# Altium schematic sheet BoostSupply.SchDoc
size A4
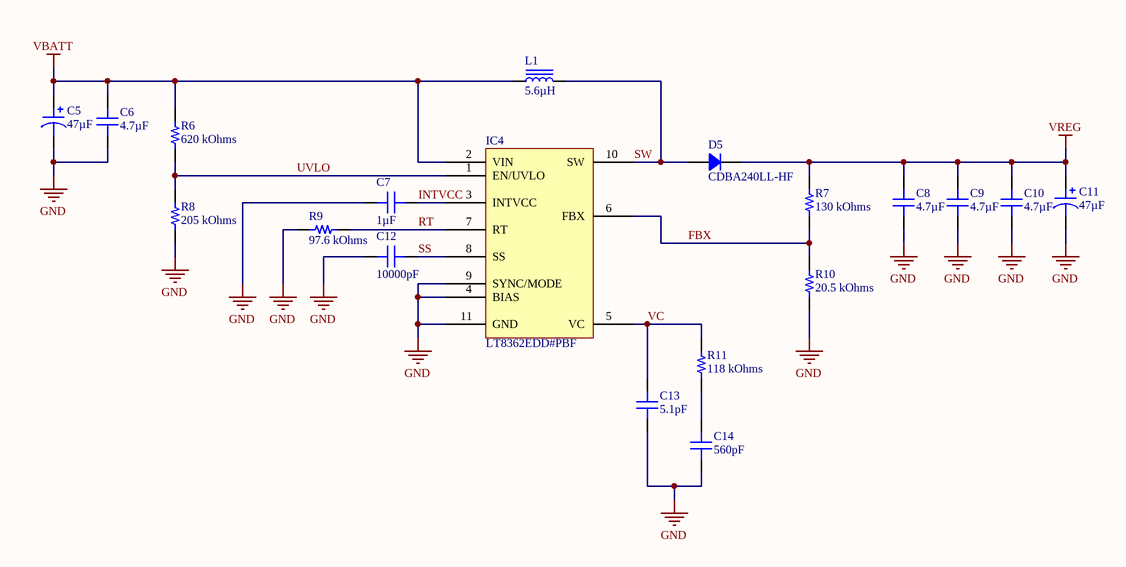
[diagram p0: BoostSupply.SchDoc]

## Parts
C5  47µF  [CAP ALSMD 6.6MM H6.1MM]
C6  4.7µF  [CAP 0805_2012]
C7  1µF  [CAP 0603_1608]
C8  4.7µF  [CAP 0805_2012]
C9  4.7µF  [CAP 0805_2012]
C10  4.7µF  [CAP 0805_2012]
C11  47µF  [CAP ALSMD 6.6MM H6.1MM]
C12  10000pF  [CAP 0603_1608]
C13  5.1pF  [CAP 0603_1608]
C14  560pF  [CAP 0603_1608]
D5  CDBA240LL-HF  [DO214AC SMA]
IC4  LT8362EDD#PBF  [ANALOG DEV DFN-10 3X3MM DD]
L1  5.6µH  [TDK SLF12575]
R6  620 kOhms  [RES 0603_1608]
R7  130 kOhms  [RES 0603_1608]
R8  205 kOhms  [RES 0603_1608]
R9  97.6 kOhms  [RES 0603_1608]
R10  20.5 kOhms  [RES 0603_1608]
R11  118 kOhms  [RES 0603_1608]

## Nets
GND: C5.2 C6.1 C7.2 C8.1 C9.1 C10.1 C11.2 C12.2 C13.1 C14.1 IC4.4(BIAS) IC4.9(SYNC/MODE) IC4.11(GND) R8.1 R9.2 R10.1
VBATT: C5.1 C6.2 IC4.2(VIN) L1.1 R6.2
VREG: C8.2 C9.2 C10.2 C11.1 D5.2 R7.2
FBX: IC4.6(FBX) R7.1 R10.2
INTVCC: C7.1 IC4.3(INTVCC)
RT: IC4.7(RT) R9.1
SS: C12.1 IC4.8(SS)
SW: D5.1 IC4.10(SW) L1.2
UVLO: IC4.1(EN/UVLO) R6.1 R8.2
VC: C13.2 IC4.5(VC) R11.2
NetC14_2: C14.2 R11.1

## Notes on the sheet
- Title
- Size:
- Date:
- A4
- Number:
- Time:
- Revision:
- Sheet
- of
- File:

## Library data of the parts
C5 C11 = HHXD250ARA470MF61G: ALUMINUM CAPACITOR; Manufacturer: United Chemi-Con; ESR (Equivalent Series Resistance): 50mOhm; Lifetime @ Temp.: 5000 Hrs @ 105°C; Ripple Current @ High Frequency: 1.3A @ 100kHz; Ripple Current @ Low Frequency: 130mA @ 120Hz; Surface Mount Land Size: 0.260" L x 0.260" W (6.60mm x 6.60mm); Tolerance: ±20%; Type: Hybrid; Voltage - Rated: 25V; Part Number: HHXD250ARA470MF61G; Applications: Automotive; Capacitance: 47µF; ComponentLink1Description: Datasheet; ComponentLink1URL: http://www.chemi-con.co.jp/cgi-bin/CAT_DB/SEARCH/cat_db_al.cgi?e=e&j=p&pdfname=hxd; ComponentLink2Description: DigiKey Link; ComponentLink2URL: http://digikey.com/product-detail/en/united-chemi-con/HHXD250ARA470MF61G/565-HHXD250ARA470MF61GCT-ND/10487166; Device Package: Radial, Can - SMD; Height - Seated (Max): 0.240" (6.10mm); LastUpdated: 21/01/2020 04:05:20; Lifecycle Status: Active; Minimum Order: 1; Mounting Type: Surface Mount; Operating Temperature: -55°C ~ 105°C; Package / Case: Radial, Can - SMD; Packaging: TapeAndReel; PartId: 2188; Part Status: Active; Price: 0.19; Ratings: AEC-Q200; Series: HXD; Size / Dimension: 0.248" Dia (6.30mm); Supplier 1: DigiKey; Supplier Part Number 1: 565-HHXD250ARA470MF61GCT-ND; Value: 47µF
C6 C8-C10 = TMK212ABJ475MG-T: CAP CER 4.7UF 25V X5R 0805; Manufacturer: Taiyo Yuden; Tolerance: ±20%; Part Number: TMK212ABJ475MG-T; Value: 4.7µF; Applications: SMPS Filtering; Capacitance: 4.7µF; ComponentLink1Description: Datasheet; ComponentLink1URL: https://ds.yuden.co.jp/TYCOMPAS/ut/detail?pn=TMK212ABJ475MG-T &u=M; ComponentLink2Description: DigiKey Link; ComponentLink2URL: http://digikey.com/product-detail/en/taiyo-yuden/TMK212ABJ475MG-T/587-4937-1-ND/6563780; Device Package: 0805 (2012 Metric); LastUpdated: 21/01/2020 00:02:54; Lifecycle Status: Active; Minimum Order: 1; Mounting Type: Surface Mount, MLCC; Operating Temperature: -55°C ~ 85°C; Package / Case: 0805 (2012 Metric); Packaging: TapeAndReel; PartId: 10740; Part Status: Active; Price: 0.03; Series: M; Size / Dimension: 0.079" L x 0.049" W (2.00mm x 1.25mm); Supplier 1: DigiKey; Supplier Part Number 1: 587-4937-1-ND; Temperature Coefficient: X5R; Thickness (Max): 0.055" (1.40mm); Voltage - Rated: 25V
C7 = CC0603KRX5R8BB105: CAP CER 1UF 25V X5R 0603; Manufacturer: Yageo; Tolerance: ±10%; Part Number: CC0603KRX5R8BB105; Value: 1µF; Applications: General Purpose; Capacitance: 1µF; ComponentLink1Description: Datasheet; ComponentLink1URL: https://www.yageo.com/upload/media/product/productsearch/datasheet/mlcc/UPY-GPHC_X5R_4V-to-50V_25.pdf; ComponentLink2Description: DigiKey Link; ComponentLink2URL: http://digikey.com/product-detail/en/yageo/CC0603KRX5R8BB105/311-1445-1-ND/2833751; Device Package: 0603 (1608 Metric); LastUpdated: 21/01/2020 00:02:05; Lifecycle Status: Active; Minimum Order: 1; Mounting Type: Surface Mount, MLCC; Operating Temperature: -55°C ~ 85°C; Package / Case: 0603 (1608 Metric); Packaging: TapeAndReel; PartId: 5146; Part Status: Active; Price: 0.01; Series: CC; Size / Dimension: 0.063" L x 0.031" W (1.60mm x 0.80mm); Supplier 1: DigiKey; Supplier Part Number 1: 311-1445-1-ND; Temperature Coefficient: X5R; Thickness (Max): 0.035" (0.90mm); Voltage - Rated: 25V
C12 = AC0603KPX7R9BB103: CAP CER 10000PF 50V X7R 0603; Manufacturer: Yageo; Tolerance: ±10%; Part Number: AC0603KPX7R9BB103; Value: 10000pF; Applications: Automotive; Capacitance: 10000pF; ComponentLink1Description: Datasheet; ComponentLink1URL: http://www.yageo.com/NewPortal/_en/search/productDocs.jsp?YageoPartNumber=AC0603KPX7R9BB103; ComponentLink2Description: DigiKey Link; ComponentLink2URL: http://digikey.com/product-detail/en/yageo/AC0603KPX7R9BB103/311-3284-1-ND/6643536; Device Package: 0603 (1608 Metric); LastUpdated: 21/01/2020 00:02:05; Lifecycle Status: Active; Minimum Order: 1; Mounting Type: Surface Mount, MLCC; Operating Temperature: -55°C ~ 125°C; Package / Case: 0603 (1608 Metric); Packaging: TapeAndReel; PartId: 5188; Part Status: Active; Price: 0.01; Ratings: AEC-Q200; Series: AC; Size / Dimension: 0.063" L x 0.031" W (1.60mm x 0.80mm); Supplier 1: DigiKey; Supplier Part Number 1: 311-3284-1-ND; Temperature Coefficient: X7R; Thickness (Max): 0.035" (0.90mm); Voltage - Rated: 50V
C13 = CL10C5R1CB8NNNC: CAP CER 5.1PF 50V C0G/NP0 0603; Manufacturer: Samsung Electro-Mechanics; Temperature Coefficient: C0G, NP0; Tolerance: ±0.25pF; Part Number: CL10C5R1CB8NNNC; Value: 5.1pF; Applications: General Purpose; Capacitance: 5.1pF; ComponentLink1Description: Datasheet; ComponentLink1URL: http://www.samsungsem.com/kr/support/product-search/mlcc/CL10C5R1CB8NNNC.jsp; ComponentLink2Description: DigiKey Link; ComponentLink2URL: http://digikey.com/product-detail/en/samsung-electro-mechanics/CL10C5R1CB8NNNC/1276-2317-1-ND/3890403; Device Package: 0603 (1608 Metric); LastUpdated: 21/01/2020 00:01:47; Lifecycle Status: Active; Minimum Order: 1; Mounting Type: Surface Mount, MLCC; Operating Temperature: -55°C ~ 125°C; Package / Case: 0603 (1608 Metric); Packaging: TapeAndReel; PartId: 14550; Part Status: Active; Price: 0.01; Series: CL; Size / Dimension: 0.063" L x 0.031" W (1.60mm x 0.80mm); Supplier 1: DigiKey; Supplier Part Number 1: 1276-2317-1-ND; Thickness (Max): 0.035" (0.90mm); Voltage - Rated: 50V
C14 = CL10C561JB8NNNC: CAP CER 560PF 50V C0G/NP0 0603; Manufacturer: Samsung Electro-Mechanics; Temperature Coefficient: C0G, NP0; Tolerance: ±5%; Part Number: CL10C561JB8NNNC; Value: 560pF; Applications: General Purpose; Capacitance: 560pF; ComponentLink1Description: Datasheet; ComponentLink1URL: http://www.samsungsem.com/kr/support/product-search/mlcc/CL10C561JB8NNNC.jsp; ComponentLink2Description: DigiKey Link; ComponentLink2URL: http://digikey.com/product-detail/en/samsung-electro-mechanics/CL10C561JB8NNNC/1276-1283-1-ND/3889369; Device Package: 0603 (1608 Metric); LastUpdated: 21/01/2020 00:01:52; Lifecycle Status: Active; Minimum Order: 1; Mounting Type: Surface Mount, MLCC; Operating Temperature: -55°C ~ 125°C; Package / Case: 0603 (1608 Metric); Packaging: TapeAndReel; PartId: 13010; Part Status: Active; Price: 0.01; Series: CL; Size / Dimension: 0.063" L x 0.031" W (1.60mm x 0.80mm); Supplier 1: DigiKey; Supplier Part Number 1: 1276-1283-1-ND; Thickness (Max): 0.035" (0.90mm); Voltage - Rated: 50V
D5 = CDBA240LL-HF: DIODE SCHOTTKY 40V 2A DO214AC; Manufacturer: Comchip Technology; Capacitance @ Vr, F: 160pF @ 4V, 1MHz; Current - Average Rectified (Io): 2A (DC); Current - Reverse Leakage @ Vr: 1mA @ 40V; Speed: Fast Recovery =< 500ns, > 200mA (Io); Voltage - Forward (Vf) (Max) @ If: 350mV @ 2A; Part Number: CDBA240LL-HF; ComponentLink1Description: Datasheet; ComponentLink1URL: http://www.comchiptech.com/admin/files/product/CDBA240LL-HF RevC514247.pdf; ComponentLink2Description: DigiKey Link; ComponentLink2URL: http://digikey.com/product-detail/en/comchip-technology/CDBA240LL-HF/641-1698-1-ND/5226081; Device Package: DO-214AC, SMA; Diode Type: Schottky; LastUpdated: 02/02/2020 10:17:39; Lifecycle Status: Active; Minimum Order: 1; Mounting Type: Surface Mount; Operating Temperature - Junction: -55°C ~ 100°C; Package / Case: DO-214AC, SMA; Packaging: TapeAndReel; PartId: 2082; Part Status: Active; Price: 0.15; Series: -; Supplier 1: DigiKey; Supplier Part Number 1: 641-1698-1-ND; Supplier Device Package: DO-214AC (SMA); Voltage - DC Reverse (Vr) (Max): 40V
IC4 = LT8362EDD#PBF: IC REG BST SEPIC 2A 10DFN; Manufacturer: Linear Technology/Analog Devices; Current - Output: 2A (Switch); Frequency - Switching: 300kHz ~ 2MHz; Function: Step-Up; Number of Outputs: 1; Output Configuration: Positive; Output Type: Fixed; Topology: Boost, SEPIC; Voltage - Input (Max): 60V; Voltage - Input (Min): 2.8V; Voltage - Output (Max): 60V (Switch); Part Number: LT8362EDD#PBF; ComponentLink1Description: Datasheet; ComponentLink1URL: http://www.analog.com/media/en/technical-documentation/data-sheets/8362fa.pdf; ComponentLink2Description: DigiKey Link; ComponentLink2URL: http://digikey.com/product-detail/en/linear-technology-analog-devices/LT8362EDD-PBF/LT8362EDD-PBF-ND/7599737; Device Package: 10-WFDFN Exposed Pad; LastUpdated: 02/02/2020 10:12:51; Lifecycle Status: Active; Minimum Order: 1; Mounting Type: Surface Mount; Operating Temperature: -40°C ~ 125°C (TJ); Package / Case: 10-WFDFN Exposed Pad; Packaging: Tube; Part Status: Active; Price: 4.49; Series: -; Supplier 1: DigiKey; Supplier Part Number 1: LT8362EDD#PBF-ND; Supplier Device Package: 10-DFN (3x3)
L1 = SLF12575T-5R6N6R3-PF: FIXED IND 5.6UH 6.3A 11.6 MOHM; Manufacturer: TDK Corporation; Current - Saturation: 7.8A; DC Resistance (DCR): 13.9mOhm Max; Inductance Frequency - Test: 1kHz; Material - Core: Ferrite; Shielding: Shielded; Tolerance: ±30%; Type: Wirewound; Part Number: SLF12575T-5R6N6R3-PF; ComponentLink1Description: Datasheet; ComponentLink1URL: https://product.tdk.com/info/en/catalog/datasheets/inductor_commercial_power_slf12575_en.pdf?ref_disty=digikey; ComponentLink2Description: DigiKey Link; ComponentLink2URL: http://digikey.com/product-detail/en/tdk-corporation/SLF12575T-5R6N6R3-PF/445-174414-1-ND/5880188; Current Rating (Amps): 6.3A; Device Package: Nonstandard; Height - Seated (Max): 0.309" (7.85mm); Inductance: 5.6µH; LastUpdated: 21/01/2020 03:26:04; Lifecycle Status: Active; Minimum Order: 1; Mounting Type: Surface Mount; Operating Temperature: -40°C ~ 105°C; Package / Case: Nonstandard; Packaging: TapeAndReel; PartId: 127; Part Status: Active; Price: 0.94; Series: SLF; Size / Dimension: 0.492" L x 0.492" W (12.50mm x 12.50mm); Supplier 1: DigiKey; Supplier Part Number 1: 445-174414-1-ND; Value: 5.6µH
R6 = ERJ-3EKF6203V: RES SMD 620K OHM 1% 1/10W 0603; Manufacturer: Panasonic Electronic Components; Power (Watts): 0.1W, 1/10W; Temperature Coefficient: ±100ppm/°C; Part Number: ERJ-3EKF6203V; Value: 620 kOhms; ComponentLink1Description: Datasheet; ComponentLink1URL: https://industrial.panasonic.com/cdbs/www-data/pdf/RDA0000/AOA0000C304.pdf; ComponentLink2Description: DigiKey Link; ComponentLink2URL: http://digikey.com/product-detail/en/panasonic-electronic-components/ERJ-3EKF6203V/P620KHCT-ND/1746799; Composition: Thick Film; Device Package: 0603 (1608 Metric); Features: Automotive AEC-Q200; Height - Seated (Max): 0.022" (0.55mm); LastUpdated: 21/01/2020 00:14:40; Lifecycle Status: Active; Minimum Order: 1; Number of Terminations: 2; Operating Temperature: -55°C ~ 155°C; Package / Case: 0603 (1608 Metric); Packaging: TapeAndReel; PartId: 26139; Part Status: Active; Price: 0.01; Ratings: AEC-Q200; Resistance: 620 kOhms; Series: ERJ; Size / Dimension: 0.063" L x 0.031" W (1.60mm x 0.80mm); Supplier 1: DigiKey; Supplier Part Number 1: P620KHCT-ND; Supplier Device Package: 0603; Tolerance: ±1%
R7 = ERJ-3EKF1303V: RES SMD 130K OHM 1% 1/10W 0603; Manufacturer: Panasonic Electronic Components; Power (Watts): 0.1W, 1/10W; Temperature Coefficient: ±100ppm/°C; Part Number: ERJ-3EKF1303V; Value: 130 kOhms; ComponentLink1Description: Datasheet; ComponentLink1URL: https://industrial.panasonic.com/cdbs/www-data/pdf/RDA0000/AOA0000C304.pdf; ComponentLink2Description: DigiKey Link; ComponentLink2URL: http://digikey.com/product-detail/en/panasonic-electronic-components/ERJ-3EKF1303V/P130KHCT-ND/198154; Composition: Thick Film; Device Package: 0603 (1608 Metric); Features: Automotive AEC-Q200; Height - Seated (Max): 0.022" (0.55mm); LastUpdated: 21/01/2020 00:17:12; Lifecycle Status: Active; Minimum Order: 1; Number of Terminations: 2; Operating Temperature: -55°C ~ 155°C; Package / Case: 0603 (1608 Metric); Packaging: TapeAndReel; PartId: 23122; Part Status: Active; Price: 0.01; Ratings: AEC-Q200; Resistance: 130 kOhms; Series: ERJ; Size / Dimension: 0.063" L x 0.031" W (1.60mm x 0.80mm); Supplier 1: DigiKey; Supplier Part Number 1: P130KHCT-ND; Supplier Device Package: 0603; Tolerance: ±1%
R8 = ERJ-3EKF2053V: RES SMD 205K OHM 1% 1/10W 0603; Manufacturer: Panasonic Electronic Components; Power (Watts): 0.1W, 1/10W; Temperature Coefficient: ±100ppm/°C; Part Number: ERJ-3EKF2053V; Value: 205 kOhms; ComponentLink1Description: Datasheet; ComponentLink1URL: https://industrial.panasonic.com/cdbs/www-data/pdf/RDA0000/AOA0000C304.pdf; ComponentLink2Description: DigiKey Link; ComponentLink2URL: http://digikey.com/product-detail/en/panasonic-electronic-components/ERJ-3EKF2053V/P205KHCT-ND/198243; Composition: Thick Film; Device Package: 0603 (1608 Metric); Features: Automotive AEC-Q200; Height - Seated (Max): 0.022" (0.55mm); LastUpdated: 21/01/2020 00:16:20; Lifecycle Status: Active; Minimum Order: 1; Number of Terminations: 2; Operating Temperature: -55°C ~ 155°C; Package / Case: 0603 (1608 Metric); Packaging: TapeAndReel; PartId: 24171; Part Status: Active; Price: 0.01; Ratings: AEC-Q200; Resistance: 205 kOhms; Series: ERJ; Size / Dimension: 0.063" L x 0.031" W (1.60mm x 0.80mm); Supplier 1: DigiKey; Supplier Part Number 1: P205KHCT-ND; Supplier Device Package: 0603; Tolerance: ±1%
R9 = ERJ-3EKF9762V: RES SMD 97.6K OHM 1% 1/10W 0603; Manufacturer: Panasonic Electronic Components; Power (Watts): 0.1W, 1/10W; Temperature Coefficient: ±100ppm/°C; Part Number: ERJ-3EKF9762V; Value: 97.6 kOhms; ComponentLink1Description: Datasheet; ComponentLink1URL: https://industrial.panasonic.com/cdbs/www-data/pdf/RDA0000/AOA0000C304.pdf; ComponentLink2Description: DigiKey Link; ComponentLink2URL: http://digikey.com/product-detail/en/panasonic-electronic-components/ERJ-3EKF9762V/P97.6KHCT-ND/198558; Composition: Thick Film; Device Package: 0603 (1608 Metric); Features: Automotive AEC-Q200; Height - Seated (Max): 0.022" (0.55mm); LastUpdated: 21/01/2020 00:16:19; Lifecycle Status: Active; Minimum Order: 1; Number of Terminations: 2; Operating Temperature: -55°C ~ 155°C; Package / Case: 0603 (1608 Metric); Packaging: TapeAndReel; PartId: 24194; Part Status: Active; Price: 0.01; Ratings: AEC-Q200; Resistance: 97.6 kOhms; Series: ERJ; Size / Dimension: 0.063" L x 0.031" W (1.60mm x 0.80mm); Supplier 1: DigiKey; Supplier Part Number 1: P97.6KHCT-ND; Supplier Device Package: 0603; Tolerance: ±1%
R10 = ERJ-3EKF2052V: RES SMD 20.5K OHM 1% 1/10W 0603; Manufacturer: Panasonic Electronic Components; Power (Watts): 0.1W, 1/10W; Temperature Coefficient: ±100ppm/°C; Part Number: ERJ-3EKF2052V; Value: 20.5 kOhms; ComponentLink1Description: Datasheet; ComponentLink1URL: https://industrial.panasonic.com/cdbs/www-data/pdf/RDA0000/AOA0000C304.pdf; ComponentLink2Description: DigiKey Link; ComponentLink2URL: http://digikey.com/product-detail/en/panasonic-electronic-components/ERJ-3EKF2052V/P20.5KHCT-ND/198239; Composition: Thick Film; Device Package: 0603 (1608 Metric); Features: Automotive AEC-Q200; Height - Seated (Max): 0.022" (0.55mm); LastUpdated: 21/01/2020 00:16:20; Lifecycle Status: Active; Minimum Order: 1; Number of Terminations: 2; Operating Temperature: -55°C ~ 155°C; Package / Case: 0603 (1608 Metric); Packaging: TapeAndReel; PartId: 24144; Part Status: Active; Price: 0.01; Ratings: AEC-Q200; Resistance: 20.5 kOhms; Series: ERJ; Size / Dimension: 0.063" L x 0.031" W (1.60mm x 0.80mm); Supplier 1: DigiKey; Supplier Part Number 1: P20.5KHCT-ND; Supplier Device Package: 0603; Tolerance: ±1%
R11 = ERJ-3EKF1183V: RES SMD 118K OHM 1% 1/10W 0603; Manufacturer: Panasonic Electronic Components; Power (Watts): 0.1W, 1/10W; Temperature Coefficient: ±100ppm/°C; Part Number: ERJ-3EKF1183V; Value: 118 kOhms; ComponentLink1Description: Datasheet; ComponentLink1URL: https://industrial.panasonic.com/cdbs/www-data/pdf/RDA0000/AOA0000C304.pdf; ComponentLink2Description: DigiKey Link; ComponentLink2URL: http://digikey.com/product-detail/en/panasonic-electronic-components/ERJ-3EKF1183V/P118KHCT-ND/198134; Composition: Thick Film; Device Package: 0603 (1608 Metric); Features: Automotive AEC-Q200; Height - Seated (Max): 0.022" (0.55mm); LastUpdated: 21/01/2020 00:14:40; Lifecycle Status: Active; Minimum Order: 1; Number of Terminations: 2; Operating Temperature: -55°C ~ 155°C; Package / Case: 0603 (1608 Metric); Packaging: TapeAndReel; PartId: 26128; Part Status: Active; Price: 0.01; Ratings: AEC-Q200; Resistance: 118 kOhms; Series: ERJ; Size / Dimension: 0.063" L x 0.031" W (1.60mm x 0.80mm); Supplier 1: DigiKey; Supplier Part Number 1: P118KHCT-ND; Supplier Device Package: 0603; Tolerance: ±1%